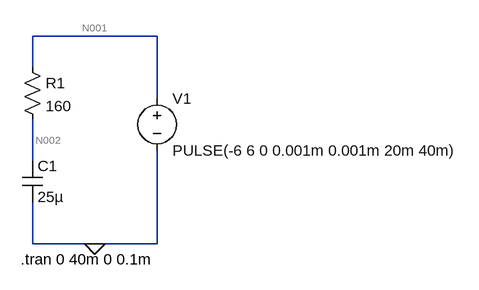
[diagram p0: schematic tran1.asc]
tran1.asc, the LTspice schematic file:
Version 4
SHEET 1 880 680
WIRE 96 48 -96 48
WIRE -96 96 -96 48
WIRE 96 144 96 48
WIRE -96 240 -96 176
WIRE -96 368 -96 304
WIRE 0 368 -96 368
WIRE 96 368 96 224
WIRE 96 368 0 368
FLAG 0 368 0
SYMBOL voltage 96 128 R0
WINDOW 123 0 0 Left 0
WINDOW 39 0 0 Left 0
SYMATTR InstName V1
SYMATTR Value PULSE(-6 6 0 0.001m 0.001m 20m 40m)
SYMBOL res -112 80 R0
SYMATTR InstName R1
SYMATTR Value 160
SYMBOL cap -112 240 R0
SYMATTR InstName C1
SYMATTR Value 25µ
TEXT -114 392 Left 2 !.tran 0 40m 0 0.1m

The netlist it stands for:
* tran1.asc
V1 N001 0 PULSE(-6 6 0 0.001m 0.001m 20m 40m)
R1 N001 N002 160
C1 N002 0 25µ
.tran 0 40m 0 0.1m
.backanno
.end

* Results of the author's LTspice run, read from the files saved beside the schematic
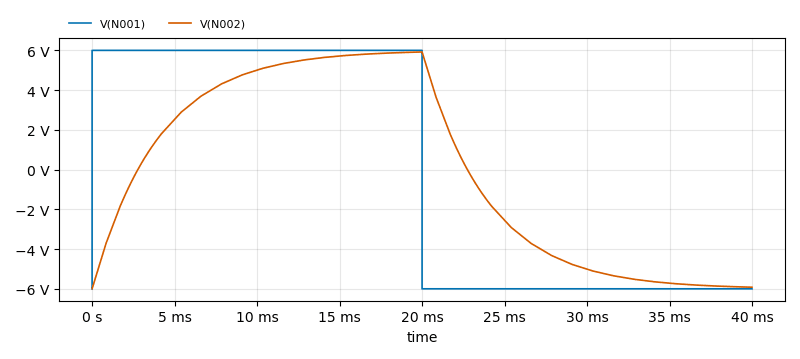
[diagram p1: Transient Analysis of tran1.asc, plotted from the saved traces]
* Transient Analysis, 1 run:
*   V(N001): min -6 V, max 6 V, average 300 µV, rms 6 V, last -6 V
*   V(N002): min -6 V, max 5.919 V, average -7.756 mV, rms 4.675 V, last -5.92 V